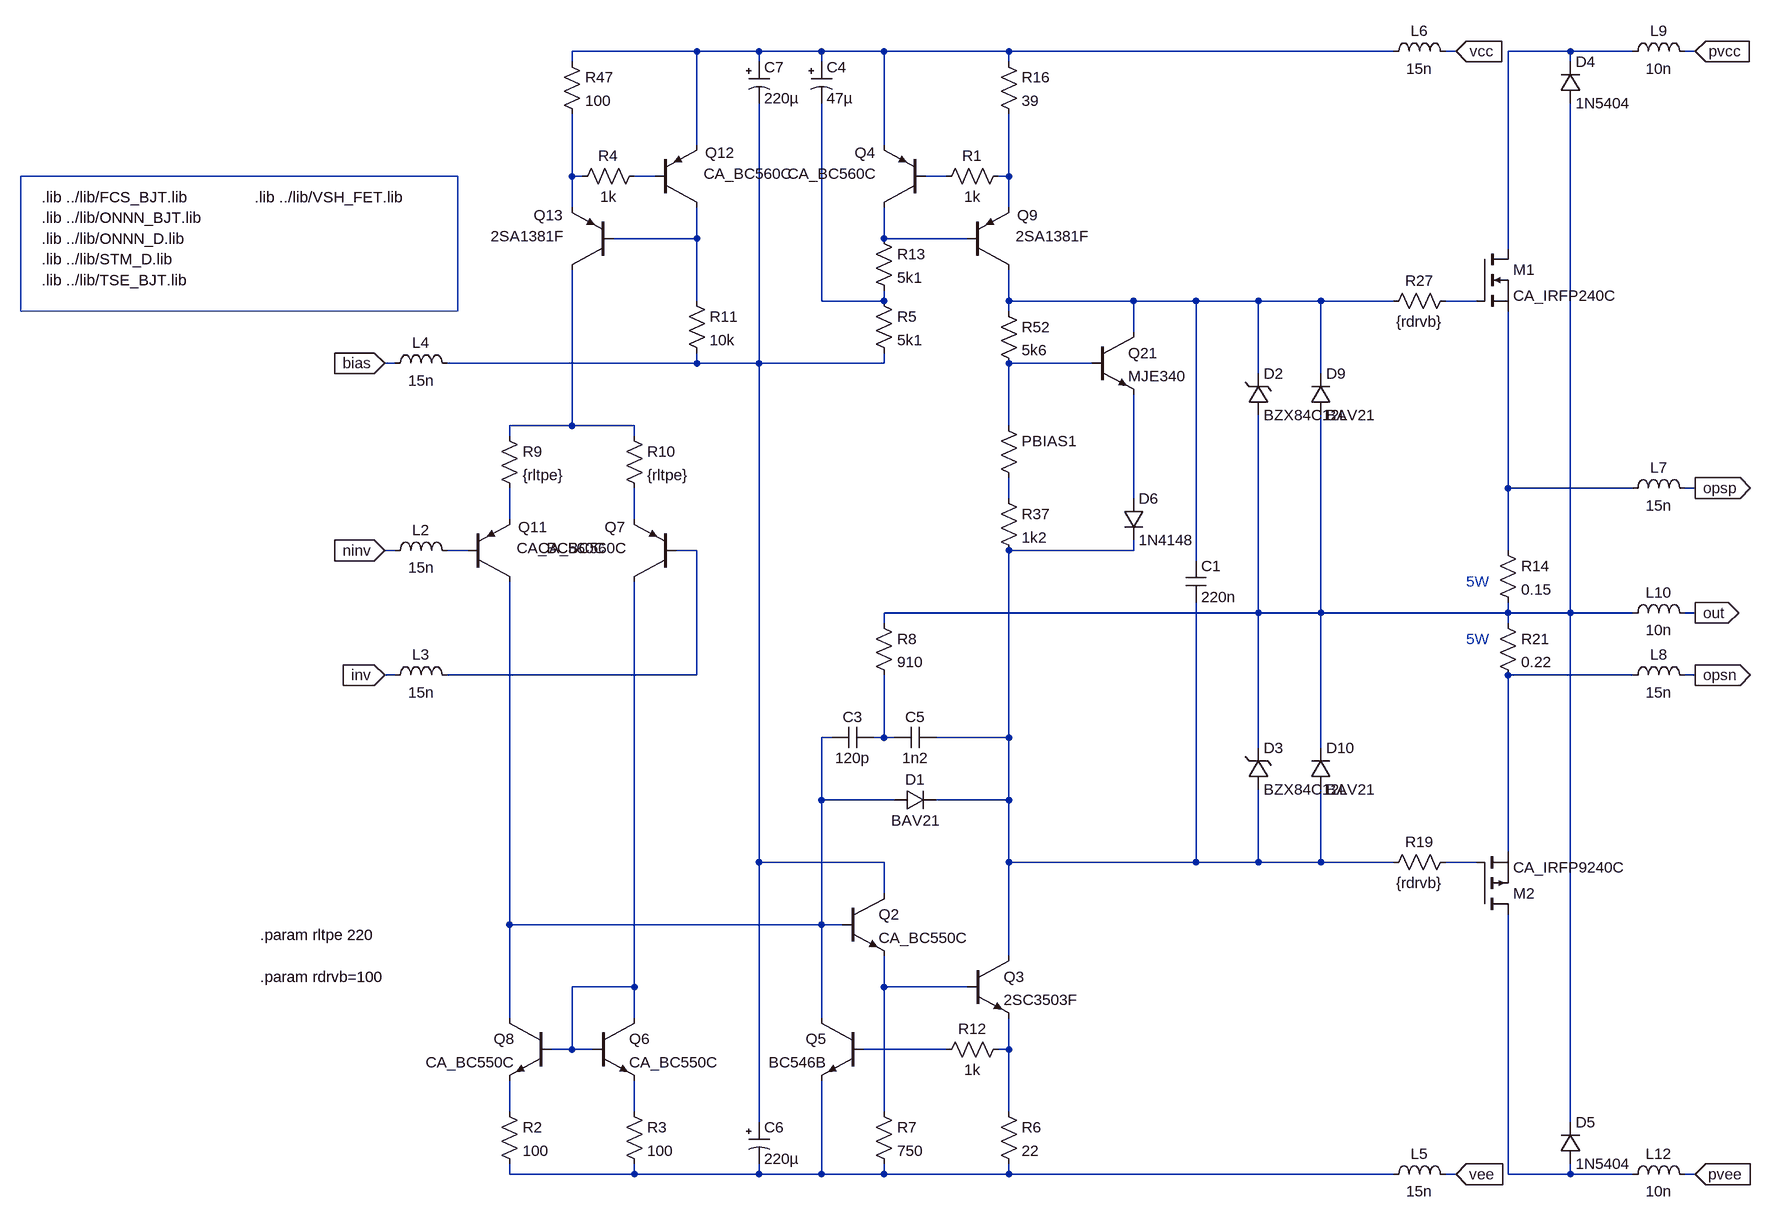
[diagram p0: schematic pab3bbb-compact-module-pp.asc]
pab3bbb-compact-module-pp.asc, the LTspice schematic file:
Version 4
SHEET 1 6124 2336
WIRE 288 -1088 96 -1088
WIRE 384 -1088 288 -1088
WIRE 480 -1088 384 -1088
WIRE 576 -1088 480 -1088
WIRE 768 -1088 576 -1088
WIRE 1360 -1088 768 -1088
WIRE 1456 -1088 1440 -1088
WIRE 1632 -1088 1536 -1088
WIRE 1728 -1088 1632 -1088
WIRE 1824 -1088 1808 -1088
WIRE 96 -1072 96 -1088
WIRE 384 -1072 384 -1088
WIRE 480 -1072 480 -1088
WIRE 768 -1072 768 -1088
WIRE 1632 -1072 1632 -1088
WIRE 288 -944 288 -1088
WIRE 576 -944 576 -1088
WIRE 96 -896 96 -992
WIRE 112 -896 96 -896
WIRE 224 -896 192 -896
WIRE 672 -896 640 -896
WIRE 768 -896 768 -992
WIRE 768 -896 752 -896
WIRE 96 -848 96 -896
WIRE 768 -848 768 -896
WIRE 288 -800 288 -848
WIRE 288 -800 160 -800
WIRE 576 -800 576 -848
WIRE 704 -800 576 -800
WIRE 1536 -784 1536 -1088
WIRE 288 -704 288 -800
WIRE 480 -704 480 -1008
WIRE 576 -704 576 -720
WIRE 576 -704 480 -704
WIRE 768 -704 768 -752
WIRE 960 -704 768 -704
WIRE 1056 -704 960 -704
WIRE 1152 -704 1056 -704
WIRE 1248 -704 1152 -704
WIRE 1360 -704 1248 -704
WIRE 1488 -704 1440 -704
WIRE 768 -688 768 -704
WIRE 960 -656 960 -704
WIRE -176 -608 -192 -608
WIRE 288 -608 288 -624
WIRE 288 -608 -96 -608
WIRE 384 -608 384 -1008
WIRE 384 -608 288 -608
WIRE 576 -608 576 -624
WIRE 576 -608 384 -608
WIRE 896 -608 768 -608
WIRE 1152 -592 1152 -704
WIRE 1248 -592 1248 -704
WIRE 96 -512 96 -752
WIRE 96 -512 0 -512
WIRE 192 -512 96 -512
WIRE 768 -512 768 -608
WIRE 0 -496 0 -512
WIRE 192 -496 192 -512
WIRE 1536 -416 1536 -688
WIRE 1728 -416 1536 -416
WIRE 1824 -416 1808 -416
WIRE 768 -400 768 -432
WIRE 960 -400 960 -560
WIRE 0 -368 0 -416
WIRE 192 -368 192 -416
WIRE -176 -320 -192 -320
WIRE -64 -320 -96 -320
WIRE 288 -320 256 -320
WIRE 960 -320 960 -336
WIRE 960 -320 768 -320
WIRE 1536 -320 1536 -416
WIRE 1056 -304 1056 -704
WIRE 1152 -224 1152 -528
WIRE 1152 -224 576 -224
WIRE 1248 -224 1248 -528
WIRE 1248 -224 1152 -224
WIRE 1536 -224 1536 -240
WIRE 1536 -224 1248 -224
WIRE 1632 -224 1632 -1008
WIRE 1632 -224 1536 -224
WIRE 1728 -224 1632 -224
WIRE 1824 -224 1808 -224
WIRE 576 -208 576 -224
WIRE 1536 -208 1536 -224
WIRE -176 -128 -192 -128
WIRE 288 -128 288 -320
WIRE 288 -128 -96 -128
WIRE 1728 -128 1536 -128
WIRE 1824 -128 1808 -128
WIRE 496 -32 480 -32
WIRE 576 -32 576 -128
WIRE 576 -32 560 -32
WIRE 592 -32 576 -32
WIRE 768 -32 768 -320
WIRE 768 -32 656 -32
WIRE 1152 -16 1152 -224
WIRE 1248 -16 1248 -224
WIRE 480 64 480 -32
WIRE 592 64 480 64
WIRE 768 64 768 -32
WIRE 768 64 656 64
WIRE 1536 144 1536 -128
WIRE 384 160 384 -608
WIRE 576 160 384 160
WIRE 768 160 768 64
WIRE 1056 160 1056 -240
WIRE 1056 160 768 160
WIRE 1152 160 1152 48
WIRE 1152 160 1056 160
WIRE 1248 160 1248 48
WIRE 1248 160 1152 160
WIRE 1360 160 1248 160
WIRE 1488 160 1440 160
WIRE 576 208 576 160
WIRE 0 256 0 -272
WIRE 480 256 480 64
WIRE 480 256 0 256
WIRE 512 256 480 256
WIRE 768 304 768 160
WIRE 192 352 192 -272
WIRE 192 352 96 352
WIRE 576 352 576 304
WIRE 704 352 576 352
WIRE 0 400 0 256
WIRE 192 400 192 352
WIRE 480 400 480 256
WIRE 96 448 96 352
WIRE 96 448 64 448
WIRE 128 448 96 448
WIRE 672 448 544 448
WIRE 768 448 768 400
WIRE 768 448 752 448
WIRE 0 544 0 496
WIRE 192 544 192 496
WIRE 576 544 576 352
WIRE 768 544 768 448
WIRE 384 560 384 160
WIRE 1632 560 1632 -224
WIRE 0 640 0 624
WIRE 192 640 192 624
WIRE 192 640 0 640
WIRE 384 640 384 624
WIRE 384 640 192 640
WIRE 480 640 480 496
WIRE 480 640 384 640
WIRE 576 640 576 624
WIRE 576 640 480 640
WIRE 768 640 768 624
WIRE 768 640 576 640
WIRE 1360 640 768 640
WIRE 1456 640 1440 640
WIRE 1536 640 1536 240
WIRE 1632 640 1632 624
WIRE 1632 640 1536 640
WIRE 1728 640 1632 640
WIRE 1824 640 1808 640
FLAG 1824 -1088 pvcc
IOPIN 1824 -1088 In
FLAG 1824 640 pvee
IOPIN 1824 640 In
FLAG 1824 -224 out
IOPIN 1824 -224 Out
FLAG 1456 -1088 vcc
IOPIN 1456 -1088 In
FLAG 1456 640 vee
IOPIN 1456 640 In
FLAG -192 -320 ninv
IOPIN -192 -320 In
FLAG -192 -128 inv
IOPIN -192 -128 In
FLAG 1824 -416 opsp
IOPIN 1824 -416 Out
FLAG 1824 -128 opsn
IOPIN 1824 -128 Out
FLAG -192 -608 bias
IOPIN -192 -608 In
SYMBOL pnp -64 -272 M180
WINDOW 0 77 84 Left 2
WINDOW 3 75 52 Left 2
SYMATTR InstName Q11
SYMATTR Value CA_BC560C
SYMBOL res -16 528 R0
SYMATTR InstName R2
SYMATTR Value 100
SYMBOL res 176 528 R0
SYMATTR InstName R3
SYMATTR Value 100
SYMBOL res -16 -512 R0
SYMATTR InstName R9
SYMATTR Value {rltpe}
SYMBOL res 176 -512 R0
SYMATTR InstName R10
SYMATTR Value {rltpe}
SYMBOL res 752 -1088 R0
SYMATTR InstName R16
SYMATTR Value 39
SYMBOL res 1456 -720 R90
WINDOW 0 0 56 VBottom 2
WINDOW 3 32 56 VTop 2
SYMATTR InstName R27
SYMATTR Value {rdrvb}
SYMBOL res 80 -1088 R0
SYMATTR InstName R47
SYMATTR Value 100
SYMBOL res 752 -528 R0
WINDOW 3 36 76 Invisible 2
SYMATTR Value {1+(500*BIAS)}
SYMATTR InstName PBIAS1
SYMBOL res 752 -704 R0
SYMATTR InstName R52
SYMATTR Value 5k6
SYMBOL npn 704 304 R0
SYMATTR InstName Q3
SYMATTR Value 2SC3503F
SYMBOL res 752 528 R0
SYMATTR InstName R6
SYMATTR Value 22
SYMBOL pnp 256 -272 R180
WINDOW 0 77 84 Left 2
WINDOW 3 75 52 Left 2
SYMATTR InstName Q7
SYMATTR Value CA_BC560C
SYMBOL npn 896 -656 R0
SYMATTR InstName Q21
SYMATTR Value MJE340
SYMBOL res 752 -416 R0
SYMATTR InstName R37
SYMATTR Value 1k2
SYMBOL cap 560 -48 R90
WINDOW 0 0 32 VBottom 2
WINDOW 3 32 32 VTop 2
SYMATTR InstName C3
SYMATTR Value 120p
SYMATTR SpiceLine V=100 Irms=20.8m Rser=5.448 Lser=3n Rpar=6.4meg Cpar=1p
SYMBOL npn 128 400 R0
SYMATTR InstName Q6
SYMATTR Value CA_BC550C
SYMBOL npn 64 400 M0
SYMATTR InstName Q8
SYMATTR Value CA_BC550C
SYMBOL npn 512 208 R0
SYMATTR InstName Q2
SYMATTR Value CA_BC550C
SYMBOL res 560 528 R0
SYMATTR InstName R7
SYMATTR Value 750
SYMBOL cap 656 -48 R90
WINDOW 0 0 32 VBottom 2
WINDOW 3 32 32 VTop 2
SYMATTR InstName C5
SYMATTR Value 1n2
SYMATTR SpiceLine V=100 Irms=75.3m Rser=2.89088 Lser=3n Rpar=4.4meg Cpar=1p
SYMBOL res 560 -224 R0
SYMATTR InstName R8
SYMATTR Value 910
SYMBOL res 1520 -336 R0
SYMATTR InstName R14
SYMATTR Value 0.15
SYMBOL res 1520 -224 R0
SYMATTR InstName R21
SYMATTR Value 0.22
SYMBOL ind 1344 656 R270
WINDOW 0 32 56 VTop 2
WINDOW 3 5 56 VBottom 2
SYMATTR InstName L5
SYMATTR Value 15n
SYMATTR SpiceLine Rser=20m
SYMBOL ind 1344 -1072 R270
WINDOW 0 32 56 VTop 2
WINDOW 3 5 56 VBottom 2
SYMATTR InstName L6
SYMATTR Value 15n
SYMATTR SpiceLine Rser=20m
SYMBOL ind 1712 -400 R270
WINDOW 0 32 56 VTop 2
WINDOW 3 5 56 VBottom 2
SYMATTR InstName L7
SYMATTR Value 15n
SYMATTR SpiceLine Rser=20m
SYMBOL ind 1712 -112 R270
WINDOW 0 32 56 VTop 2
WINDOW 3 5 56 VBottom 2
SYMATTR InstName L8
SYMATTR Value 15n
SYMATTR SpiceLine Rser=20m
SYMBOL ind -192 -304 R270
WINDOW 0 32 56 VTop 2
WINDOW 3 5 56 VBottom 2
SYMATTR InstName L2
SYMATTR Value 15n
SYMATTR SpiceLine Rser=20m
SYMBOL ind -192 -112 R270
WINDOW 0 32 56 VTop 2
WINDOW 3 5 56 VBottom 2
SYMATTR InstName L3
SYMATTR Value 15n
SYMATTR SpiceLine Rser=20m
SYMBOL ind 1712 -208 R270
WINDOW 0 32 56 VTop 2
WINDOW 3 5 56 VBottom 2
SYMATTR InstName L10
SYMATTR Value 10n
SYMATTR SpiceLine Rser=10m
SYMBOL ind 1712 -1072 R270
WINDOW 0 32 56 VTop 2
WINDOW 3 5 56 VBottom 2
SYMATTR InstName L9
SYMATTR Value 10n
SYMATTR SpiceLine Rser=10m
SYMBOL ind 1712 656 R270
WINDOW 0 32 56 VTop 2
WINDOW 3 5 56 VBottom 2
SYMATTR InstName L12
SYMATTR Value 10n
SYMATTR SpiceLine Rser=10m
SYMBOL ind -192 -592 R270
WINDOW 0 32 56 VTop 2
WINDOW 3 5 56 VBottom 2
SYMATTR InstName L4
SYMATTR Value 15n
SYMATTR SpiceLine Rser=20m
SYMBOL polcap 368 -1072 R0
SYMATTR InstName C7
SYMATTR Value 220µ
SYMATTR SpiceLine V=63 Irms=2.77 Rser=0.070 Lser=5n Rpar=900k Cpar=3p
SYMATTR Description Capacitor
SYMATTR Type cap
SYMBOL npn 544 400 M0
SYMATTR InstName Q5
SYMATTR Value BC546B
SYMBOL res 768 432 R90
WINDOW 0 0 56 VBottom 2
WINDOW 3 32 56 VTop 2
SYMATTR InstName R12
SYMATTR Value 1k
SYMBOL zener 1136 -528 M180
WINDOW 0 24 64 Left 2
WINDOW 3 24 0 Left 2
SYMATTR InstName D2
SYMATTR Value BZX84C12L
SYMATTR Description Diode
SYMATTR Type diode
SYMBOL diode 1616 -1008 M180
WINDOW 0 24 64 Left 2
WINDOW 3 24 0 Left 2
SYMATTR InstName D4
SYMATTR Value 1N5404
SYMBOL diode 1616 624 M180
WINDOW 0 24 64 Left 2
WINDOW 3 24 0 Left 2
SYMATTR InstName D5
SYMATTR Value 1N5404
SYMBOL res 1456 144 R90
WINDOW 0 0 56 VBottom 2
WINDOW 3 32 56 VTop 2
SYMATTR InstName R19
SYMATTR Value {rdrvb}
SYMBOL nmos 1488 -784 R0
SYMATTR InstName M1
SYMATTR Value CA_IRFP240C
SYMBOL pmos 1488 240 M180
SYMATTR InstName M2
SYMATTR Value CA_IRFP9240C
SYMBOL diode 944 -400 R0
SYMATTR InstName D6
SYMATTR Value 1N4148
SYMBOL pnp 640 -848 R180
WINDOW 0 77 84 Left 2
WINDOW 3 75 52 Left 2
SYMATTR InstName Q4
SYMATTR Value CA_BC560C
SYMBOL res 768 -912 R90
WINDOW 0 0 56 VBottom 2
WINDOW 3 32 56 VTop 2
SYMATTR InstName R1
SYMATTR Value 1k
SYMBOL res 560 -720 R0
SYMATTR InstName R5
SYMATTR Value 5k1
SYMBOL pnp 704 -752 M180
WINDOW 0 77 84 Left 2
WINDOW 3 75 52 Left 2
SYMATTR InstName Q9
SYMATTR Value 2SA1381F
SYMBOL pnp 224 -848 M180
WINDOW 0 77 84 Left 2
WINDOW 3 75 52 Left 2
SYMATTR InstName Q12
SYMATTR Value CA_BC560C
SYMBOL res 208 -912 R90
WINDOW 0 0 56 VBottom 2
WINDOW 3 32 56 VTop 2
SYMATTR InstName R4
SYMATTR Value 1k
SYMBOL pnp 160 -752 R180
WINDOW 0 77 84 Left 2
WINDOW 3 75 52 Left 2
SYMATTR InstName Q13
SYMATTR Value 2SA1381F
SYMBOL res 272 -720 R0
SYMATTR InstName R11
SYMATTR Value 10k
SYMBOL diode 592 48 M90
WINDOW 0 0 32 VBottom 2
WINDOW 3 32 32 VTop 2
SYMATTR InstName D1
SYMATTR Value BAV21
SYMBOL zener 1136 48 M180
WINDOW 0 24 64 Left 2
WINDOW 3 24 0 Left 2
SYMATTR InstName D3
SYMATTR Value BZX84C12L
SYMATTR Description Diode
SYMATTR Type diode
SYMBOL diode 1232 -528 M180
WINDOW 0 24 64 Left 2
WINDOW 3 24 0 Left 2
SYMATTR InstName D9
SYMATTR Value BAV21
SYMBOL diode 1232 48 M180
WINDOW 0 24 64 Left 2
WINDOW 3 24 0 Left 2
SYMATTR InstName D10
SYMATTR Value BAV21
SYMBOL cap 1040 -304 R0
SYMATTR InstName C1
SYMATTR Value 220n
SYMATTR SpiceLine V=63 Irms=100m Rser=16m Lser=3n Rpar=3Meg Cpar=1p
SYMBOL polcap 464 -1072 R0
SYMATTR InstName C4
SYMATTR Value 47µ
SYMATTR SpiceLine V=63 Irms=2.77 Rser=0.070 Lser=5n Rpar=900k Cpar=3p
SYMATTR Description Capacitor
SYMATTR Type cap
SYMBOL polcap 368 560 R0
SYMATTR InstName C6
SYMATTR Value 220µ
SYMATTR SpiceLine V=63 Irms=2.77 Rser=0.070 Lser=5n Rpar=900k Cpar=3p
SYMATTR Description Capacitor
SYMATTR Type cap
SYMBOL res 560 -816 R0
SYMATTR InstName R13
SYMATTR Value 5k1
TEXT -384 272 Left 2 !.param rltpe 220
TEXT 1472 -272 Left 2 ;5W
TEXT 1472 -184 Left 2 ;5W
TEXT -720 -832 Left 2 !.lib ../lib/ONNN_BJT.lib
TEXT -720 -768 Left 2 !.lib ../lib/STM_D.lib
TEXT -720 -864 Left 2 !.lib ../lib/FCS_BJT.lib
TEXT -720 -800 Left 2 !.lib ../lib/ONNN_D.lib
TEXT -720 -736 Left 2 !.lib ../lib/TSE_BJT.lib
TEXT -384 336 Left 2 !.param rdrvb=100
TEXT -392 -864 Left 2 !.lib ../lib/VSH_FET.lib
RECTANGLE Normal -80 -688 -752 -896

The netlist it stands for:
* pab3bbb-compact-module-pp.asc
Q11 N025 N020 N018 0 CA_BC560C
R2 N032 N034 100
R3 N033 N034 100
R9 N014 N018 {rltpe}
R10 N014 N019 {rltpe}
R16 N001 N006 39
R27 N011 N010 {rdrvb}
R47 N001 N003 100
R§PBIAS1 N013 N016 {1+(500*BIAS)}
R52 N010 N013 5k6
Q3 N022 N029 N031 0 2SC3503F
R6 N031 N034 22
Q7 N028 N021 N019 0 CA_BC560C
Q21 N010 N013 N017 0 MJE340
R37 N016 N022 1k2
C3 N026 N025 120p V=100 Irms=20.8m Rser=5.448 Lser=3n Rpar=6.4meg Cpar=1p
Q6 N028 N028 N033 0 CA_BC550C
Q8 N025 N028 N032 0 CA_BC550C
Q2 N012 N025 N029 0 CA_BC550C
R7 N029 N034 750
C5 N022 N026 1n2 V=100 Irms=75.3m Rser=2.89088 Lser=3n Rpar=4.4meg Cpar=1p
R8 N023 N026 910
R14 N015 N023 0.15
R21 N023 N024 0.22
L5 N034 vee 15n Rser=20m
L6 N001 vcc 15n Rser=20m
L7 N015 opsp 15n Rser=20m
L8 N024 opsn 15n Rser=20m
L2 ninv N020 15n Rser=20m
L3 inv N021 15n Rser=20m
L10 N023 out 10n Rser=10m
L9 N002 pvcc 10n Rser=10m
L12 N035 pvee 10n Rser=10m
L4 bias N012 15n Rser=20m
C7 N001 N012 220µ V=63 Irms=2.77 Rser=0.070 Lser=5n Rpar=900k Cpar=3p
Q5 N025 N030 N034 0 BC546B
R12 N031 N030 1k
D2 N023 N010 BZX84C12L
D4 N023 N002 1N5404
D5 N035 N023 1N5404
R19 N027 N022 {rdrvb}
M1 N002 N011 N015 N015 CA_IRFP240C
M2 N035 N027 N024 N024 CA_IRFP9240C
D6 N017 N022 1N4148
Q4 N008 N005 N001 0 CA_BC560C
R1 N006 N005 1k
R5 N009 N012 5k1
Q9 N010 N008 N006 0 2SA1381F
Q12 N007 N004 N001 0 CA_BC560C
R4 N004 N003 1k
Q13 N014 N007 N003 0 2SA1381F
R11 N007 N012 10k
D1 N025 N022 BAV21
D3 N022 N023 BZX84C12L
D9 N023 N010 BAV21
D10 N022 N023 BAV21
C1 N010 N022 220n V=63 Irms=100m Rser=16m Lser=3n Rpar=3Meg Cpar=1p
C4 N001 N009 47µ V=63 Irms=2.77 Rser=0.070 Lser=5n Rpar=900k Cpar=3p
C6 N012 N034 220µ V=63 Irms=2.77 Rser=0.070 Lser=5n Rpar=900k Cpar=3p
R13 N008 N009 5k1
.model D D
.lib standard.dio
.model NPN NPN
.model PNP PNP
.lib standard.bjt
.model NMOS NMOS
.model PMOS PMOS
.lib standard.mos
.param rltpe 220
* 5W
* 5W
.lib ../lib/ONNN_BJT.lib
.lib ../lib/STM_D.lib
.lib ../lib/FCS_BJT.lib
.lib ../lib/ONNN_D.lib
.lib ../lib/TSE_BJT.lib
.param rdrvb=100
.lib ../lib/VSH_FET.lib
.backanno
.end